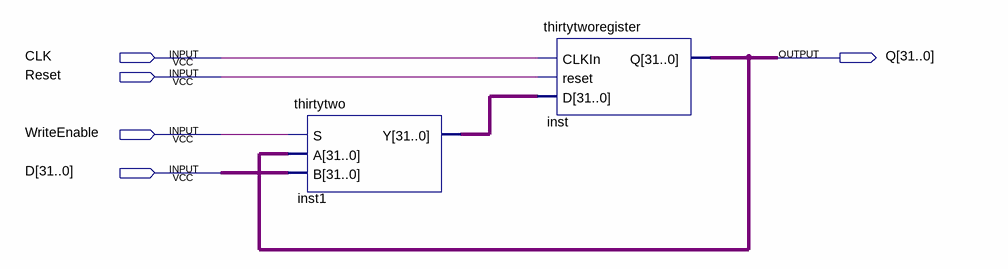
[diagram p0: schematic sheet]
// Quartus schematic writenableregister.bdf as structural Verilog: 2 symbols, 5 pins
module writenableregister (
  input  CLK,
  input  Reset,
  input  WriteEnable,
  input  [31:0] D,
  output [31:0] Q
);

  wire [31:0] inst1_y;

  thirtytwo inst1 (.S(WriteEnable), .A(Q), .B(D), .Y(inst1_y));
  thirtytworegister inst (.CLKIn(CLK), .reset(Reset), .D(inst1_y), .Q(Q));
endmodule
